# EAGLE design circuit (EAGLE 7.1.0)
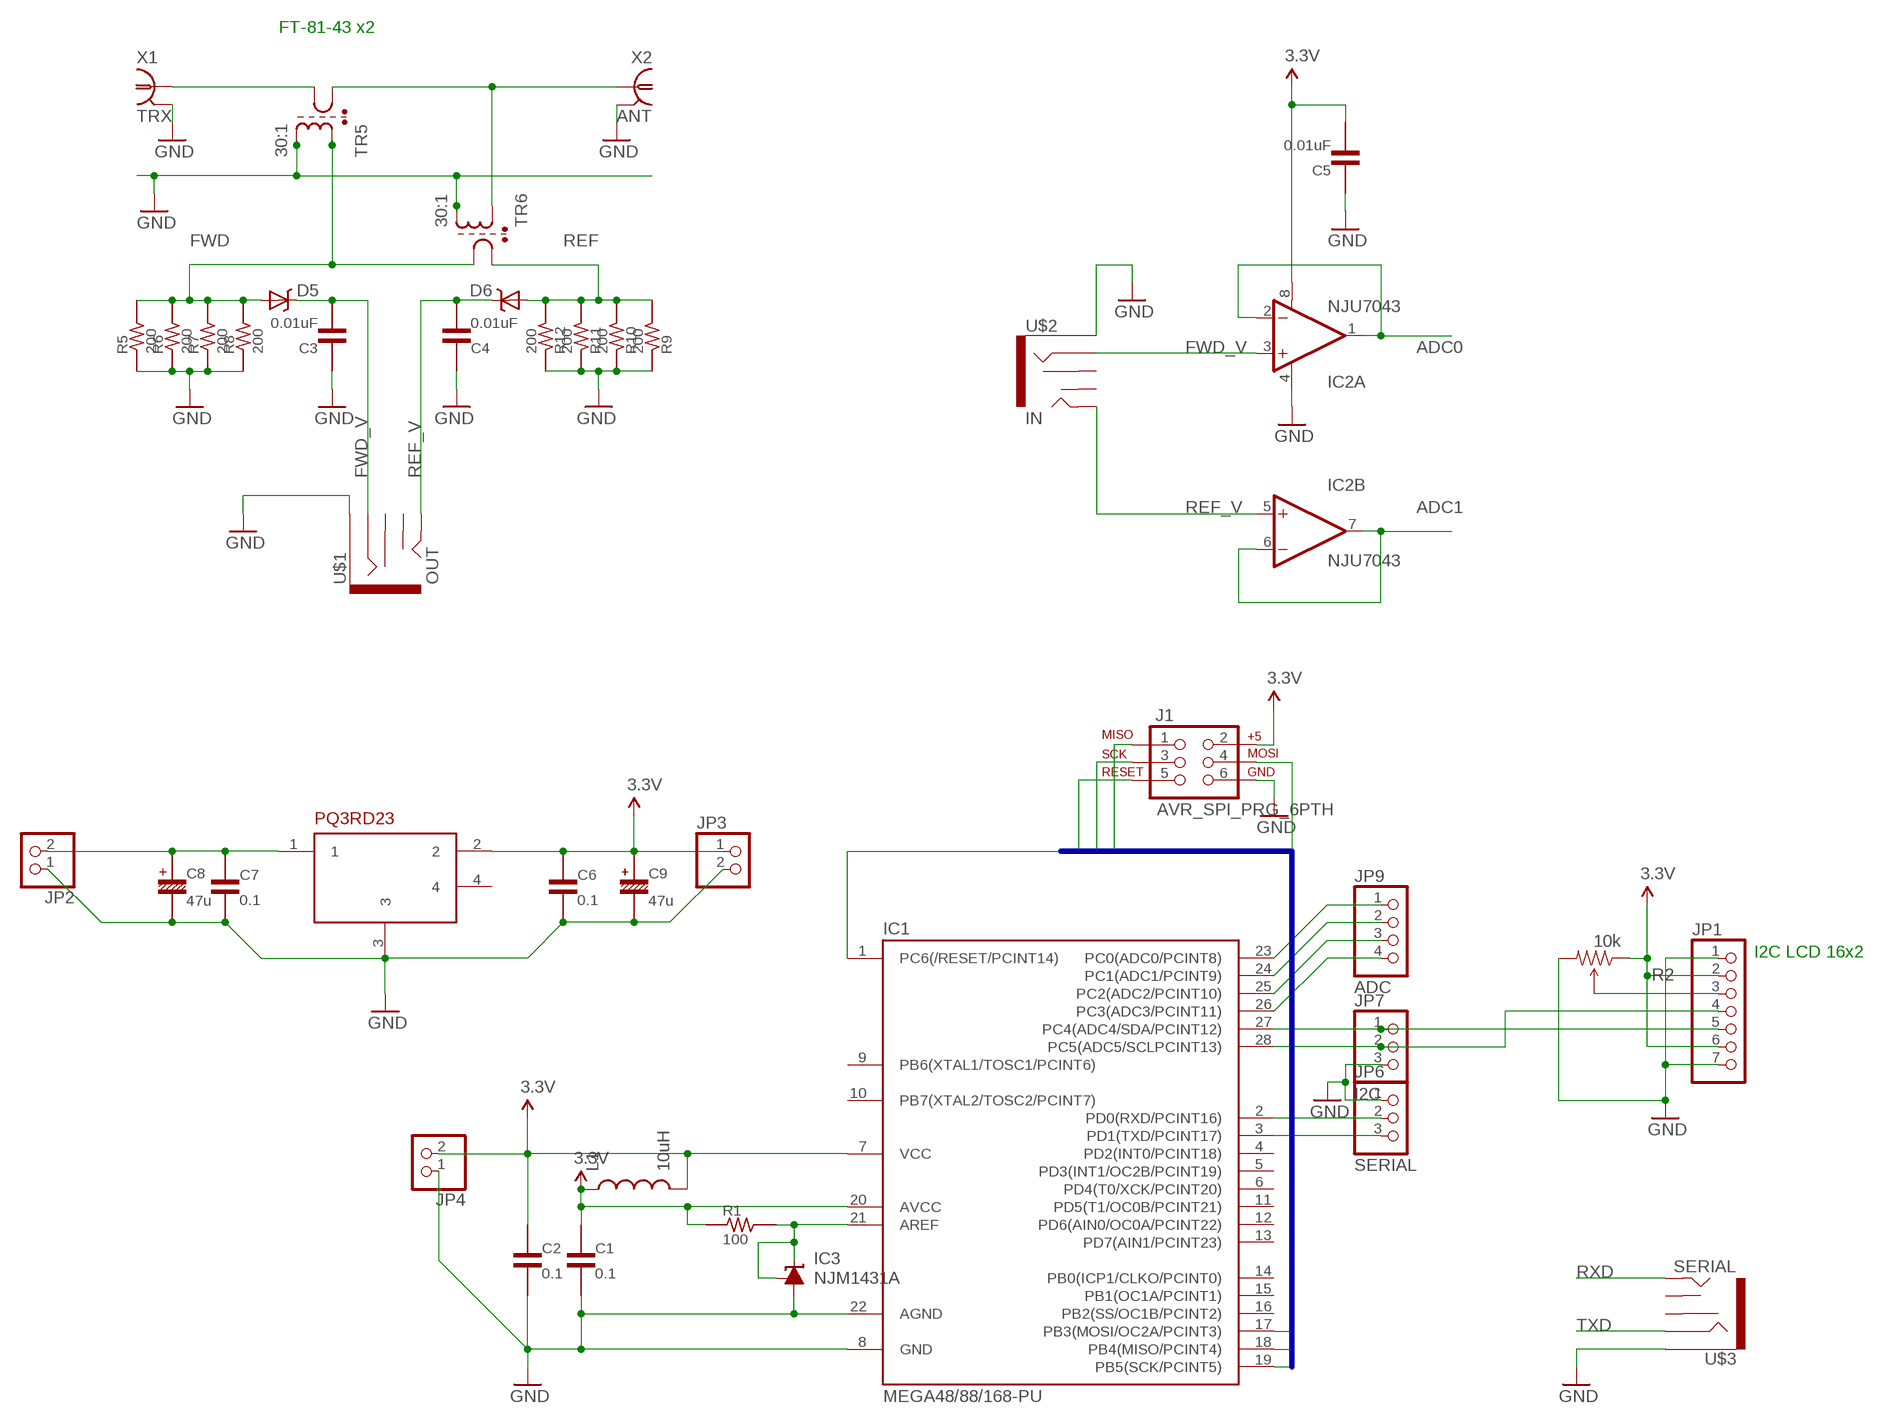
[diagram p0: schematic, sheet 1]

## Parts
C1  0.1  C-50V-0302-5.08  [50-0302-5.08]
C2  0.1  C-50V-0302-2.54  [50-0302-2.54]
C3  0.01uF  C-50V-0302-2.54  [50-0302-2.54]
C4  0.01uF  C-50V-0302-2.54  [50-0302-2.54]
C5  0.01uF  C-50V-0302-2.54  [50-0302-2.54]
C6  0.1  C-50V-0302-2.54  [50-0302-2.54]
C7  0.1  C-50V-0302-2.54  [50-0302-2.54]
C8  47u  CE-16V-04-2.54  [16V-4-2.54]
C9  47u  CE-16V-04-2.54  [16V-4-2.54]
D5  B340A  [SMA-DIODE]
D6  B340A  [SMA-DIODE]
IC1  MEGA48/88/168-PU  [DIL28-3]
IC2  NJU7043  OPAMP-DUALDIP  [DIP08]
IC3  NJM1431A  [TO-92]
J1  AVR_SPI_PRG_6PTH  [2X3]
JP1  PINHD-1X7  [1X07]
JP2  PINHD-1X2  [1X02]
JP3  PINHD-1X2  [1X02]
JP4  PINHD-1X2  [1X02]
JP6  SERIAL  PINHD-1X3  [1X03]
JP7  I2C  PINHD-1X3  [1X03]
JP9  ADC  PINHD-1X4  [1X04]
L1  10uH  INDUCTORAXIAL-0.6  [AXIAL-0.6]
PQ3RD23  PQ3RD23  PQRD  [TO-220-4]
R1  100  R-1/4W-05.08-V  [1/4W-5.08V]
R2  10k  TRIMPOTPTH  [TRIM_POT_PTH]
R5  200  R-1/4W-07.62  [1/4W-7.62H]
R6  200  R-1/4W-07.62  [1/4W-7.62H]
R7  200  R-1/4W-07.62  [1/4W-7.62H]
R8  200  R-1/4W-07.62  [1/4W-7.62H]
R9  200  R-1/4W-07.62  [1/4W-7.62H]
R10  200  R-1/4W-07.62  [1/4W-7.62H]
R11  200  R-1/4W-07.62  [1/4W-7.62H]
R12  200  R-1/4W-07.62  [1/4W-7.62H]
TR5  30:1  SMR6-2W  [SM-R6]
TR6  30:1  SMR6-2W  [SM-R6]
U$1  OUT  AUDIO-JACK2SMD  [AUDIO-JACK-3.5MM-SMD]
U$2  IN  AUDIO-JACK2SMD  [AUDIO-JACK-3.5MM-SMD]
U$3  SERIAL  AUDIO-JACK2SMD  [AUDIO-JACK-3.5MM-SMD]
X1  TRX  R141426  [R141426]
X2  ANT  R141426  [R141426]

## Nets
3.3V: C1.PAD1 C2.PAD1 C5.PAD2 C6.PAD1 C9.+ IC1.7(VCC) IC1.20(AVCC) IC2.8(A:V+) J1.2 JP1.2 JP1.6 JP3.1 JP4.2 L1.P$1 L1.P$2 PQ3RD23.2 R1.PAD1 R2.1(CCW)
ADC0: IC1.23(PC0(ADC0/PCINT8)) IC2.1(A:OUT) IC2.2(A:-IN) JP9.1
ADC1: IC1.24(PC1(ADC1/PCINT9)) IC2.6(B:-IN) IC2.7(B:OUT) JP9.2
FWD: D5.A R5.PAD2 R6.PAD2 R7.PAD2 R8.PAD2 TR5.5 TR6.3
FWD1: D6.A R9.PAD2 R10.PAD2 R11.PAD2 R12.PAD2
FWD_V: C3.PAD2 D5.C IC2.3(A:+IN) U$1.RING U$2.RING
GND: C1.PAD2 C2.PAD2 C3.PAD1 C4.PAD1 C5.PAD1 C6.PAD2 C7.PAD2 C8.- C9.- IC1.8(GND) IC1.22(AGND) IC2.4(A:V-) IC3.2(A) J1.6 JP1.1 JP1.7 JP2.1 JP3.2 JP4.1 JP6.1 JP7.3 PQ3RD23.3 R2.3(CW) R5.PAD1 R6.PAD1 R7.PAD1 R8.PAD1 R9.PAD1 R10.PAD1 R11.PAD1 R12.PAD1 TR5.4 TR6.4 U$1.SLEEVE U$2.SLEEVE U$3.SLEEVE X1.2 X1.3 X1.4 X1.5 X2.2 X2.3 X2.4 X2.5
MISO: IC1.18(PB4(MISO/PCINT4)) J1.1
MOSI: IC1.17(PB3(MOSI/OC2A/PCINT3)) J1.4
N$1: IC1.21(AREF) IC3.1(FB) IC3.3(C) R1.PAD2
N$2: C7.PAD1 C8.+ JP2.2 PQ3RD23.1
N$3: JP1.3 R2.2(WIPER)
N$5: IC1.27(PC4(ADC4/SDA/PCINT12)) JP1.5 JP7.1
N$13: IC1.3(PD1(TXD/PCINT17)) JP6.3
N$14: IC1.2(PD0(RXD/PCINT16)) JP6.2
N$16: IC1.28(PC5(ADC5/SCLPCINT13)) JP1.4 JP7.2
N$21: IC1.25(PC2(ADC2/PCINT10)) JP9.3
N$22: IC1.26(PC3(ADC3/PCINT11)) JP9.4
N$23: TR5.3 X1.1
N$24: TR5.1 TR6.5 X2.1
REF: TR6.1
REF_V: C4.PAD2 D6.C IC2.5(B:+IN) U$1.TIP U$2.TIP
RESET: IC1.1(PC6(/RESET/PCINT14)) J1.5
RXD: U$3.TIP
SCK: IC1.19(PB5(SCK/PCINT5)) J1.3
TXD: U$3.RING
Unconnected: IC1.4(PD2(INT0/PCINT18)) IC1.5(PD3(INT1/OC2B/PCINT19)) IC1.6(PD4(T0/XCK/PCINT20)) IC1.9(PB6(XTAL1/TOSC1/PCINT6)) IC1.10(PB7(XTAL2/TOSC2/PCINT7)) IC1.11(PD5(T1/OC0B/PCINT21)) IC1.12(PD6(AIN0/OC0A/PCINT22)) IC1.13(PD7(AIN1/PCINT23)) IC1.14(PB0(ICP1/CLKO/PCINT0)) IC1.15(PB1(OC1A/PCINT1)) IC1.16(PB2(SS/OC1B/PCINT2)) PQ3RD23.4 U$1.RSH U$1.TSH U$2.RSH U$2.TSH U$3.RSH U$3.TSH

## Buses
MISO,SCK,RESET,MOSI

## Notes on the sheet
- FT-81-43 x2
- I2C LCD 16x2

## Library data of the parts
C1 C3-C5 = c-j:C-: CAPACITOR Japanese symbol
C2 C6 C7 = my:C-: CAPACITOR Japanese symbol
C8 C9 = my:CE-: ELECTROLYTIC CAPACITOR Japanese symbol
D5 D6 = SparkFun-DiscreteSemi:B340A: Schottky Diode 3A-40V; PROD_ID: DIO-09886
IC1 = avr-7:MEGA48/88/168-PU
IC2 = SparkFun-AnalogIC:OPAMP-DUAL: Generic op-amp footprint
IC3 = my:NJM1431A: PRECISION MICROPOWER SHUNT VOLTAGE REFERENCE Adjustable Output Source: http://focus.ti.com/lit/ds/slcs146e/slcs146e.pdf
J1 = SparkFun-Connectors:AVR_SPI_PRG_6: AVR ISP 6 Pin This is the reduced ISP connector for AVR programming. Common on Arduino. This footprint will take up less PCB space and can be used with a 10-pin to 6-pin adapter such as SKU: BOB-08508
JP1 = pinhead:PINHD-1X7: PIN HEADER
JP2-JP4 = pinhead:PINHD-1X2: PIN HEADER
JP6 JP7 = pinhead:PINHD-1X3: PIN HEADER
JP9 = pinhead:PINHD-1X4: PIN HEADER
L1 = SparkFun-Passives:INDUCTOR: Inductors Basic Inductor/Choke - 0603 and 1206. Footprints are not proven and vary greatly between part numbers.
PQ3RD23 = my:PQ*RD*
R1 R5-R12 = my:R-: RESISTOR Japanese symbol
R2 = SparkFun-Electromechanical:TRIMPOT: Various small potentiometers for "set-and-forget" applications
TR5 TR6 = my:SMR6-2W: TRANSFORMER SMD toroidal-core transformer with 2 windings
U$1-U$3 = SparkFun-Connectors:AUDIO-JACK2: Stereo audio jack with bypass switches.
X1 X2 = con-coax:R141426: BNC COAX CONNECTOR Radiall 50/75 Ohm Spoerle; MF: FARNELL; MPN: R141426161; OC_FARNELL: 4195115; OC_NEWARK: 14J7919

## Board
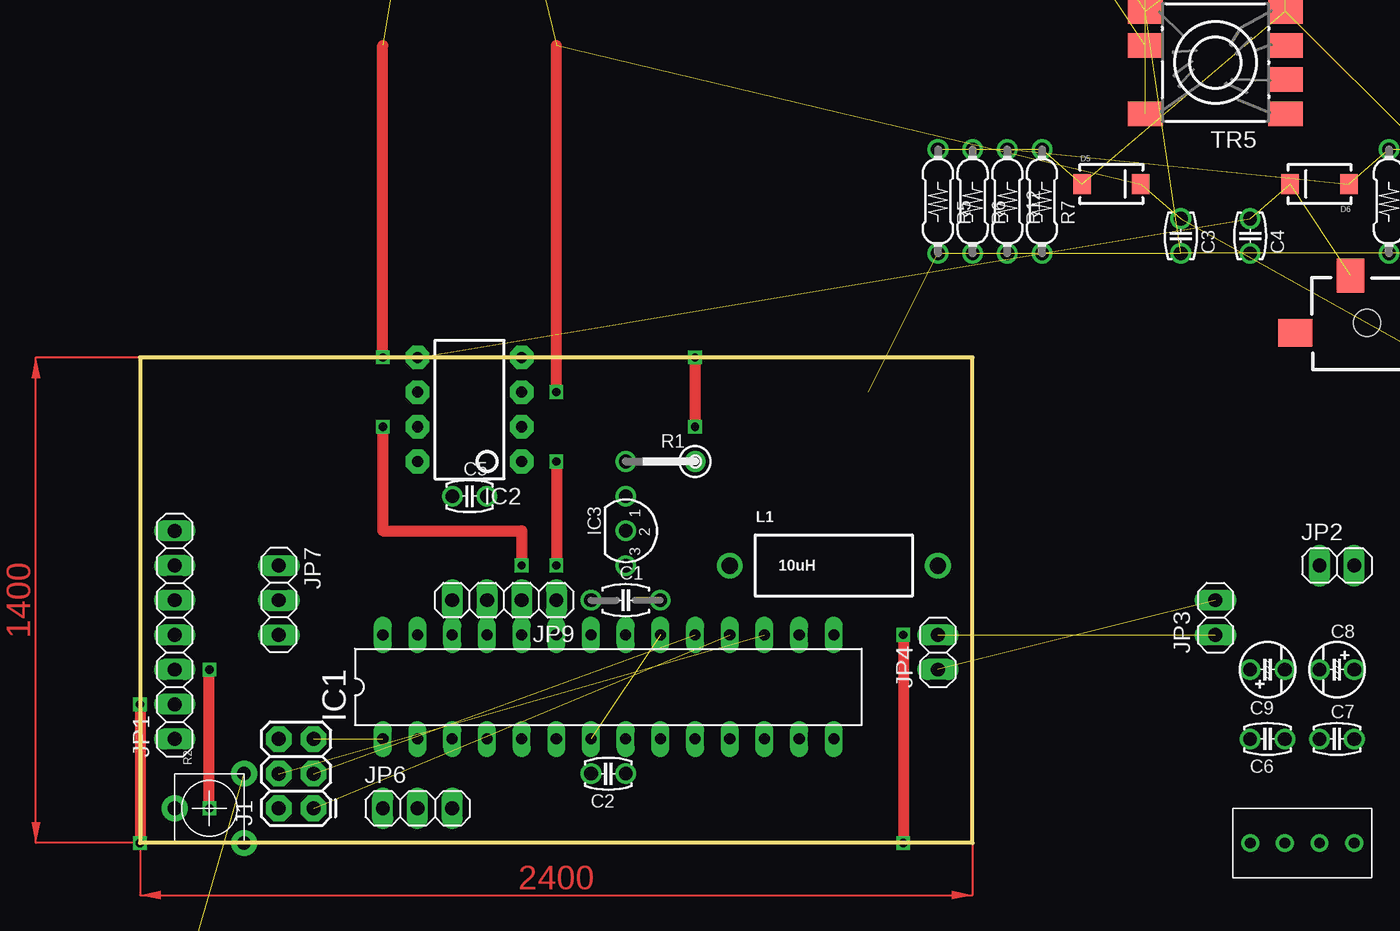
[diagram p1: board, top side]
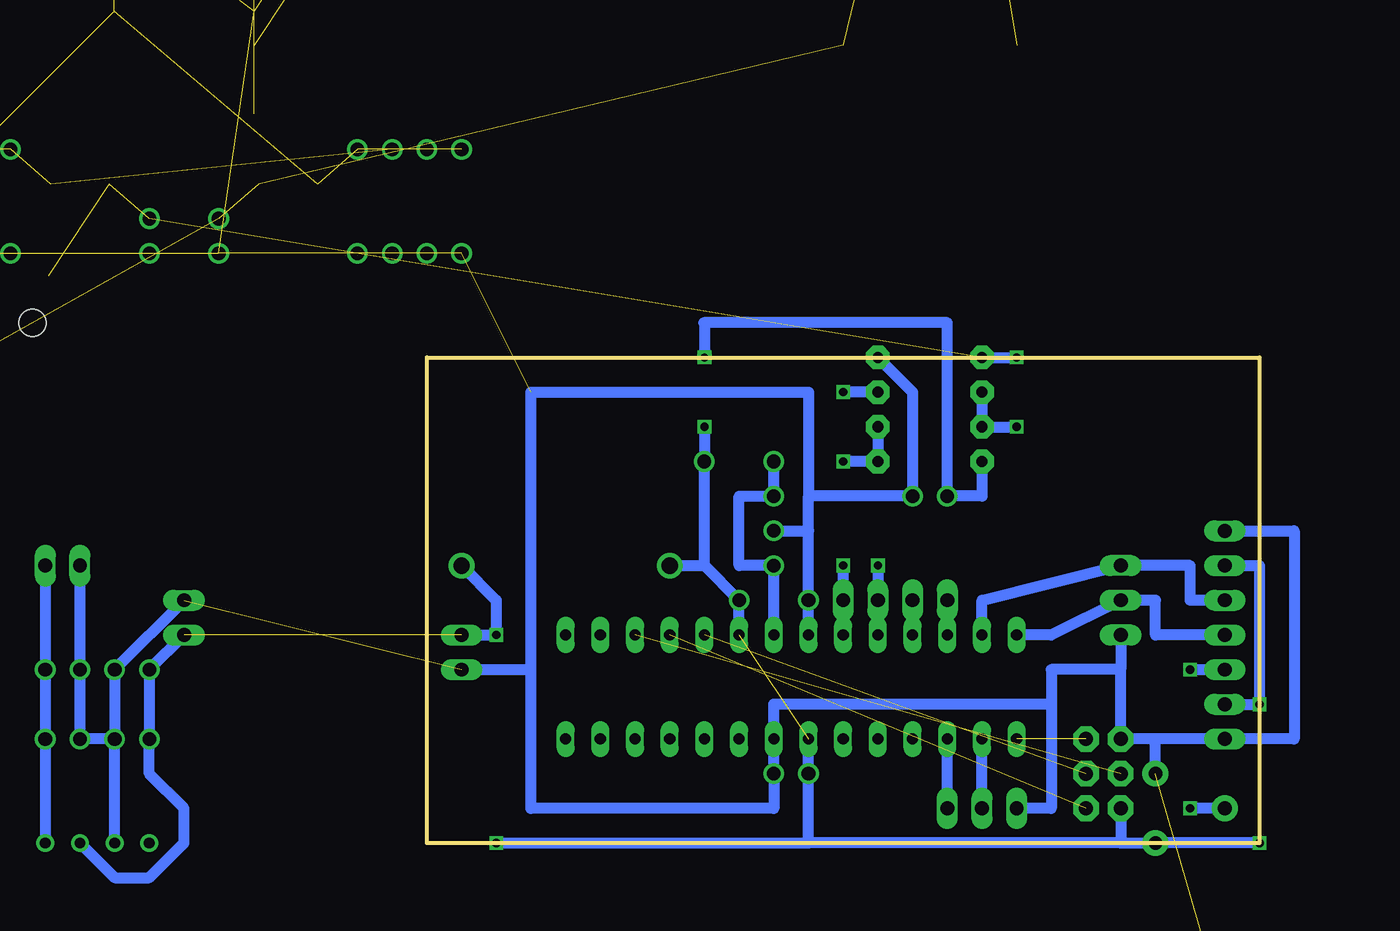
[diagram p2: board, bottom side, seen from below]

Size 60.96 x 35.56 mm. Coordinates in mm from the lower left corner, seen from the top.
Outline: 0,35.56 0,0 60.96,0 60.96,35.56 0,35.56
Copper layers (1*16): Top 0.035mm / dielectric 1.5mm / Bottom 0.035mm
Design rules "default": minimum track width 10mil, minimum drill 24mil, track to track 8mil, track to pad 8mil, pad to pad 8mil, via to via 8mil, smd to smd 8mil, copper to edge 40mil, drill to drill 8mil, minimum pad ring 10mil, minimum via ring 8mil, stop-mask expansion 4mil, vias tented up to drill 0mil, thermal gap 10mil

### Footprints (pad centres in the part's own frame; a part is rotated, then mirrored left to right if it is on the bottom)
50-0302-5.08 = drill 1: PAD1 -2.54,0; PAD2 2.54,0
50-0302-2.54 = drill 1: PAD1 -1.27,0; PAD2 1.27,0
16V-4-2.54 = drill 1: + -1.27,0; - 1.27,0
SMA-DIODE = smd 1.27 x 1.47: A -2.15,0; C 2.15,0
DIL28-3 = drill 0.813 long: 1 -16.51,-3.81; 2 -13.97,-3.81; 3 -11.43,-3.81; 4 -8.89,-3.81; 5 -6.35,-3.81; 6 -3.81,-3.81; 7 -1.27,-3.81; 8 1.27,-3.81; 9 3.81,-3.81; 10 6.35,-3.81; 11 8.89,-3.81; 12 11.43,-3.81; 13 13.97,-3.81; 14 16.51,-3.81; 15 16.51,3.81; 16 13.97,3.81; 17 11.43,3.81; 18 8.89,3.81; 19 6.35,3.81; 20 3.81,3.81; 21 1.27,3.81; 22 -1.27,3.81; 23 -3.81,3.81; 24 -6.35,3.81; 25 -8.89,3.81; 26 -11.43,3.81; 27 -13.97,3.81; 28 -16.51,3.81
DIP08 = drill 0.813 pad 1.727 octagon: 1 -3.81,-3.81; 2 -1.27,-3.81; 3 1.27,-3.81; 4 3.81,-3.81; 5 3.81,3.81; 6 1.27,3.81; 7 -1.27,3.81; 8 -3.81,3.81
TO-92 = drill 1: 1 -2.54,0; 2 0,0; 3 2.54,0
2X3 = drill 1.016 pad 1.88 octagon: 1 0,0; 2 0,2.54; 3 2.54,0; 4 2.54,2.54; 5 5.08,0; 6 5.08,2.54
1X07 = drill 1.016 long: 1 -7.62,0; 2 -5.08,0; 3 -2.54,0; 4 0,0; 5 2.54,0; 6 5.08,0; 7 7.62,0
1X02 = drill 1.016 long: 1 -1.27,0; 2 1.27,0
1X03 = drill 1.016 long: 1 -2.54,0; 2 0,0; 3 2.54,0
1X04 = drill 1.016 long: 1 -3.81,0; 2 -1.27,0; 3 1.27,0; 4 3.81,0
AXIAL-0.6 = drill 1.2 pad 1.88: P$1 -7.62,0; P$2 7.62,0
TO-220-4 = drill 0.8: 1 -3.81,0; 2 -1.27,0; 3 1.27,0; 4 3.81,0
1/4W-5.08V = drill 1: PAD1 0,0; PAD2 5.08,0
TRIM_POT_PTH = drill 1 pad 1.88: 1 -2.54,-2.54; 2 0,2.54; 3 2.54,-2.54
1/4W-7.62H = drill 1: PAD1 -3.81,0; PAD2 3.81,0
SM-R6 = smd 1.8 x 2.55: 1 -3.75,5.125; 3 1.25,5.125; 4 3.75,5.125; 5 3.75,-5.125; 6 1.25,-5.125; 7 -1.25,-5.125; 8 -3.75,-5.125
AUDIO-JACK-3.5MM-SMD = smd 2 x 2.5: RING 4.3,3.45; SLEEVE 2.5,-3.45; TIP 11.7,-3.45 | smd 1.2 x 2.5: RSH 1.5,3.45 | smd 2.5 x 2: TSH 15.75,0.75 | hole 2: 3.5,0; 10.5,0
R141426 = drill 1.295: 1 0,0; 2 5.08,5.08; 3 -5.08,5.08; 4 -5.08,-5.08; 5 5.08,-5.08

### Placement (x,y rotation side)
C1  35.56,17.78 180 top
C2  34.29,5.08 0 top
C3  76.2,44.45 90 top  (outside the outline)
C4  81.28,44.45 90 top  (outside the outline)
C5  24.13,25.4 180 top
C6  82.55,7.62 0 top  (outside the outline)
C7  87.63,7.62 180 top  (outside the outline)
C8  87.63,12.7 180 top  (outside the outline)
C9  82.55,12.7 0 top  (outside the outline)
D5  71.12,48.26 0 top  (outside the outline)
D6  86.36,48.26 180 top  (outside the outline)
IC1  34.29,11.43 0 top
IC2  24.13,31.75 90 top
IC3  35.56,22.86 270 top
J1  12.7,2.54 90 top
JP1  2.54,15.24 90 top
JP2  87.63,20.32 0 top  (outside the outline)
JP3  78.74,16.51 90 top  (outside the outline)
JP4  58.42,13.97 90 top
JP6  20.32,2.54 0 top
JP7  10.16,17.78 270 top
JP9  26.67,17.78 180 top
L1  50.8,20.32 0 top
PQ3RD23  85.09,0 180 top  (outside the outline)
R1  40.64,27.94 180 top
R2  5.08,2.54 90 top
R5  58.42,46.99 90 top  (outside the outline)
R6  60.96,46.99 90 top  (outside the outline)
R7  66.04,46.99 90 top  (outside the outline)
R8  93.98,46.99 90 top  (outside the outline)
R9  99.06,46.99 90 top  (outside the outline)
R10  91.44,46.99 90 top  (outside the outline)
R11  96.52,46.99 90 top  (outside the outline)
R12  63.5,46.99 90 top  (outside the outline)
TR5  78.74,57.15 90 top  (outside the outline)
TR6  78.74,72.39 270 top  (outside the outline)
U$1  100.33,38.1 180 top  (outside the outline)
U$2  22.86,80.01 270 top  (outside the outline)
U$3  -7.62,-35.56 0 top  (outside the outline)
X1  63.5,73.66 0 top  (outside the outline)
X2  93.98,73.66 0 top  (outside the outline)

### Tracks (layer width: path | path; a pad name or v marks a point on that pad's centre or on a via)
3.3V  (via drill 0.6)  (2 unrouted)
  Top 0.813: v0,10.16 v0,0 | v55.88,15.24 v55.88,0 | v40.64,35.56 v40.64,30.48
  Bottom 0.813: IC1.7 C2.PAD1 33.02,0 | J1.2 10.16,0 | 10.16,0 33.02,0 | v55.88,0 33.02,0 | IC2.8 20.32,25.4 C5.PAD2 22.86,38.1 40.68,38.1 40.64,38.06 v40.64,35.56 | IC1.20 C1.PAD1 40.64,20.32 | JP1.6 0,20.32 v0,10.16 JP1.2 | L1.P$1 40.64,20.32 | 40.64,20.32 R1.PAD1 v40.64,30.48 | v0,0 R2.1 10.16,0 | JP4.2 v55.88,15.24 55.88,17.78 L1.P$2 | PQ3RD23.2 83.82,-2.54 81.28,-2.54 78.74,0 78.74,2.54 81.28,5.08 C6.PAD1 C9.+ JP3.1
ADC0  (via drill 0.6)
  Top 0.813: v30.48,27.94 v30.48,20.32
  Bottom 0.813: IC2.2 IC2.1 v30.48,27.94 | IC1.23 JP9.1 v30.48,20.32
ADC1  (via drill 0.6)
  Top 0.813: v17.78,30.48 17.78,22.86 27.94,22.86 v27.94,20.32
  Bottom 0.813: IC2.6 IC2.7 v17.78,30.48 | IC1.24 JP9.2 v27.94,20.32
FWD  (6 unrouted)
FWD1  (4 unrouted)
FWD_V  (via drill 0.6)  (4 unrouted)
  Top 0.813: v30.48,33.02 30.48,58.42
  Bottom 0.813: IC2.3 v30.48,33.02
GND  (24 unrouted)
  Bottom 0.813: IC1.22 C1.PAD2 33.02,22.86 | 33.02,22.86 33.02,25.4 | 33.02,25.4 C5.PAD1 25.4,33.02 IC2.4 | 15.24,10.16 35.56,10.16 IC1.8 C2.PAD2 35.56,2.54 53.34,2.54 53.34,12.7 | 10.16,12.7 J1.6 7.62,7.62 | 10.16,12.7 15.24,12.7 15.24,10.16 | 15.24,10.16 15.24,2.54 JP6.1 | IC3.2 33.02,22.86 | JP7.3 10.16,12.7 | 7.62,7.62 JP1.1 -2.54,7.62 -2.54,22.86 JP1.7 | R2.3 7.62,7.62 | 53.34,12.7 53.34,33.02 33.02,33.02 33.02,25.4 | JP4.1 53.34,12.7 | C6.PAD2 C9.- JP3.2 | JP2.1 C8.- C7.PAD2 C6.PAD2 | PQ3RD23.3 C6.PAD2
MISO  (1 unrouted)
MOSI  (1 unrouted)
N$1
  Bottom 0.813: IC1.21 IC3.3 38.1,20.32 38.1,25.4 IC3.1 R1.PAD2
N$2
  Bottom 0.813: JP2.2 C8.+ C7.PAD1 PQ3RD23.1
N$3  (via drill 0.6)
  Top 0.813: v5.08,2.54 v5.08,12.7
  Bottom 0.813: R2.2 v5.08,2.54 | v5.08,12.7 JP1.3
  other vias: 2.54,12.7
N$5
  Bottom 0.813: IC1.27 20.32,17.78 JP7.1 5.08,20.32 5.08,17.78 JP1.5
N$13
  Bottom 0.813: JP6.3 IC1.3
N$14
  Bottom 0.813: JP6.2 IC1.2
N$16
  Bottom 0.813: IC1.28 15.24,15.24 JP7.2 7.62,17.78 7.62,15.24 JP1.4
N$21
  Bottom 0.813: JP9.3 IC1.25
N$22
  Bottom 0.813: JP9.4 IC1.26
N$23  (1 unrouted)
N$24  (2 unrouted)
REF_V  (via drill 0.6)  (4 unrouted)
  Top 0.813: v17.78,35.56 17.78,58.42
  Bottom 0.813: IC2.5 v17.78,35.56
RESET  (1 unrouted)
SCK  (1 unrouted)
(copper drawn outside any net)
  shapes: Top area x2